# EAGLE schematic Telemetry Board (EAGLE 7.6.0)
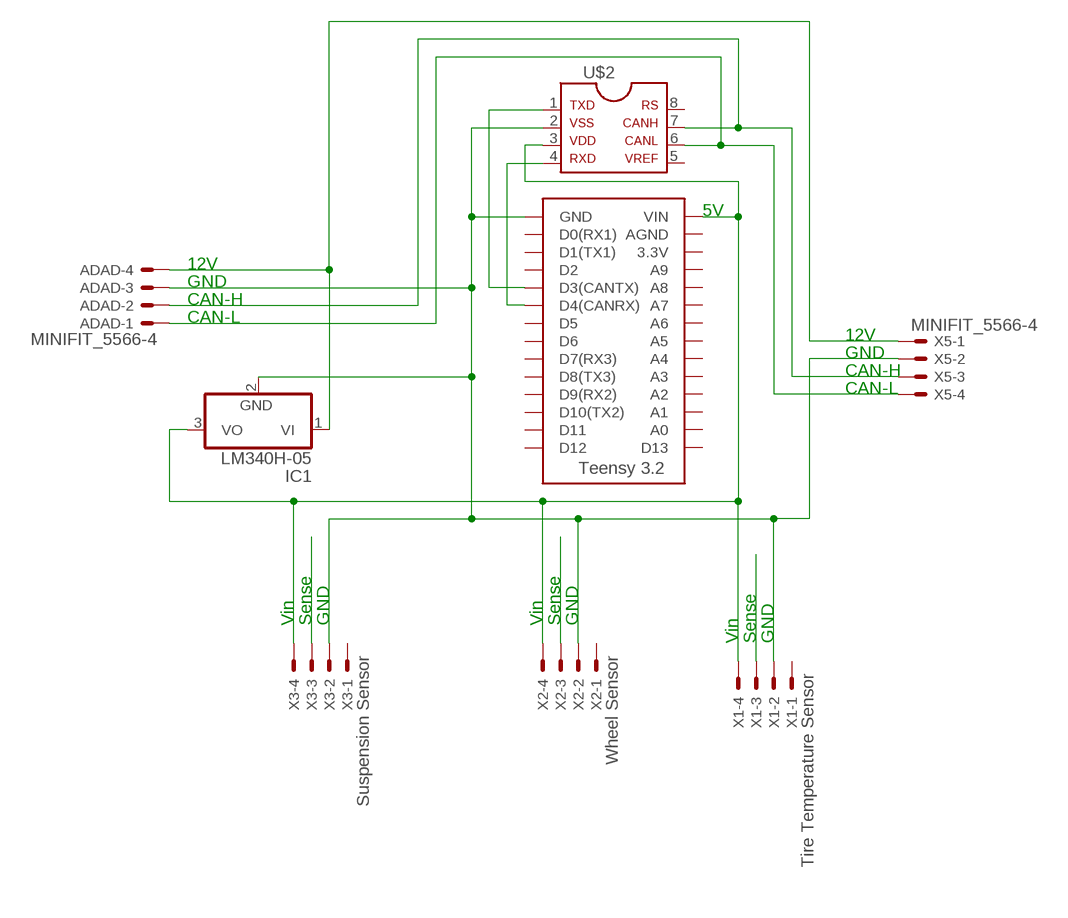
[diagram p0: schematic, sheet 1]

## Parts
ADAD  MINIFIT_5566-4  [MINIFIT_5566-4]
IC1  LM340H-05  [TO220H]
U$1  TEENSY_3.2_SIMPLE  [TEENSY_3.2_SIMPLE]
U$2  MCP2551  [DIL08]
X1  Tire Temperature Sensor  MINIFIT_5566-4  [MINIFIT_5566-4]
X2  Wheel Sensor  MINIFIT_5566-4  [MINIFIT_5566-4]
X3  Suspension Sensor  MINIFIT_5566-4  [MINIFIT_5566-4]
X5  MINIFIT_5566-4  [MINIFIT_5566-4]

## Nets
N$1: ADAD.4 IC1.1(VI) X5.1
N$3: ADAD.2 U$2.7 X5.3
N$4: ADAD.1 U$2.6 X5.4
N$6: ADAD.3 IC1.2(GND) U$1.GND U$2.2 X1.2 X2.2 X3.2 X5.2
N$9: U$1.D3(CANTX) U$2.1
N$10: U$1.D4(CANRX) U$2.4
N$12: X3.3
N$13: IC1.3(VO) U$1.VIN U$2.3 X1.4 X2.4 X3.4
N$16: X2.3
N$19: X1.3
Unconnected: U$1.3.3V U$1.A0 U$1.A1 U$1.A2 U$1.A3 U$1.A4 U$1.A5 U$1.A6 U$1.A7 U$1.A8 U$1.A9 U$1.AGND U$1.D0(RX1) U$1.D1(TX1) U$1.D2 U$1.D5 U$1.D6 U$1.D7(RX3) U$1.D8(TX3) U$1.D9(RX2) U$1.D10(TX2) U$1.D11 U$1.D12 U$1.D13 U$2.5 U$2.8 X1.1 X2.1 X3.1

## Notes on the sheet
- 5V
- 12V
- GND
- CAN-H
- CAN-L
- 12V
- GND
- CAN-H
- CAN-L
- Vin | Sense | GND | Vin | Sense | GND
- Vin | Sense | GND

## Library data of the parts
ADAD X1-X3 X5 = HyTechDevices:MINIFIT_5566-4: Mini FIT Junior connector 4 pole Source: http://www.molex.com; OC_FARNELL: unknown; OC_NEWARK: unknown
IC1 = linear:LM340?-*: Positive VOLTAGE REGULATOR Source: http://cache.national.com/ds/LM/LM340.pdf
U$1 = HyTechDevices:TEENSY_3.2_SIMPLE: Simple version of the Teensy 3.2 board that only uses the 2 main rows of pins, not the inner pins or the pins opposite the usb port.
U$2 = HyTechDevices:MCP2551: MCP2551 High-Speed CAN Transceiver Product Webpage <https://www.microchip.com/wwwproducts/en/MCP2551> Datasheet <http://ww1.microchip.com/downloads/en/DeviceDoc/21667f.pdf> This device is outdated It is replaced by MCP2561. Comparison Page <https://www.microchip.com/wwwproducts/ProductCompare/MCP2551/MCP2561> Product Webpage <https://www.microchip.com/wwwproducts/en/MCP2561> Datasheet <http://ww1.microchip.com/downloads/en/DeviceDoc/20005167C.pdf>